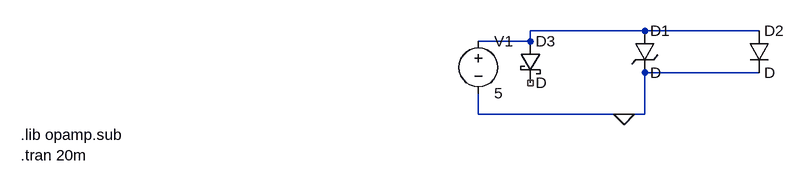
[diagram p0: schematic Draft1.asc]
Draft1.asc, the LTspice schematic file:
Version 4
SHEET 1 1052 680
WIRE 832 288 656 288
WIRE 1008 288 832 288
WIRE 656 304 656 288
WIRE 656 304 576 304
WIRE 1008 352 832 352
WIRE 576 416 576 384
WIRE 800 416 576 416
WIRE 832 416 832 352
WIRE 832 416 800 416
FLAG 800 416 0
SYMBOL zener 816 288 R0
SYMATTR InstName D1
SYMBOL diode 992 288 R0
SYMATTR InstName D2
SYMBOL schottky 640 304 R0
SYMATTR InstName D3
SYMBOL voltage 576 288 R0
SYMATTR InstName V1
SYMATTR Value 5
TEXT -128 448 Left 2 !.lib opamp.sub\n.tran 20m

The netlist it stands for:
* Draft1.asc
D1 N001 0 D
D2 N001 0 D
D3 N001 NC_01 D
V1 N001 0 5
.model D D
.lib standard.dio
.lib opamp.sub
.tran 20m
.backanno
.end